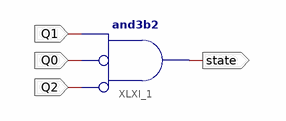
[diagram p0: schematic sheet 1]
// Xilinx ISE schematic StateSelAnl.sch (spartan3e) as structural Verilog: 1 symbols, 4 ports
module StateSelAnl (
  input  Q1,
  input  Q0,
  input  Q2,
  output state
);

  and XLXI_1 (state, ~Q2, ~Q0, Q1);  // and3b2
endmodule
